# Altium project Convertor.PrjPCB
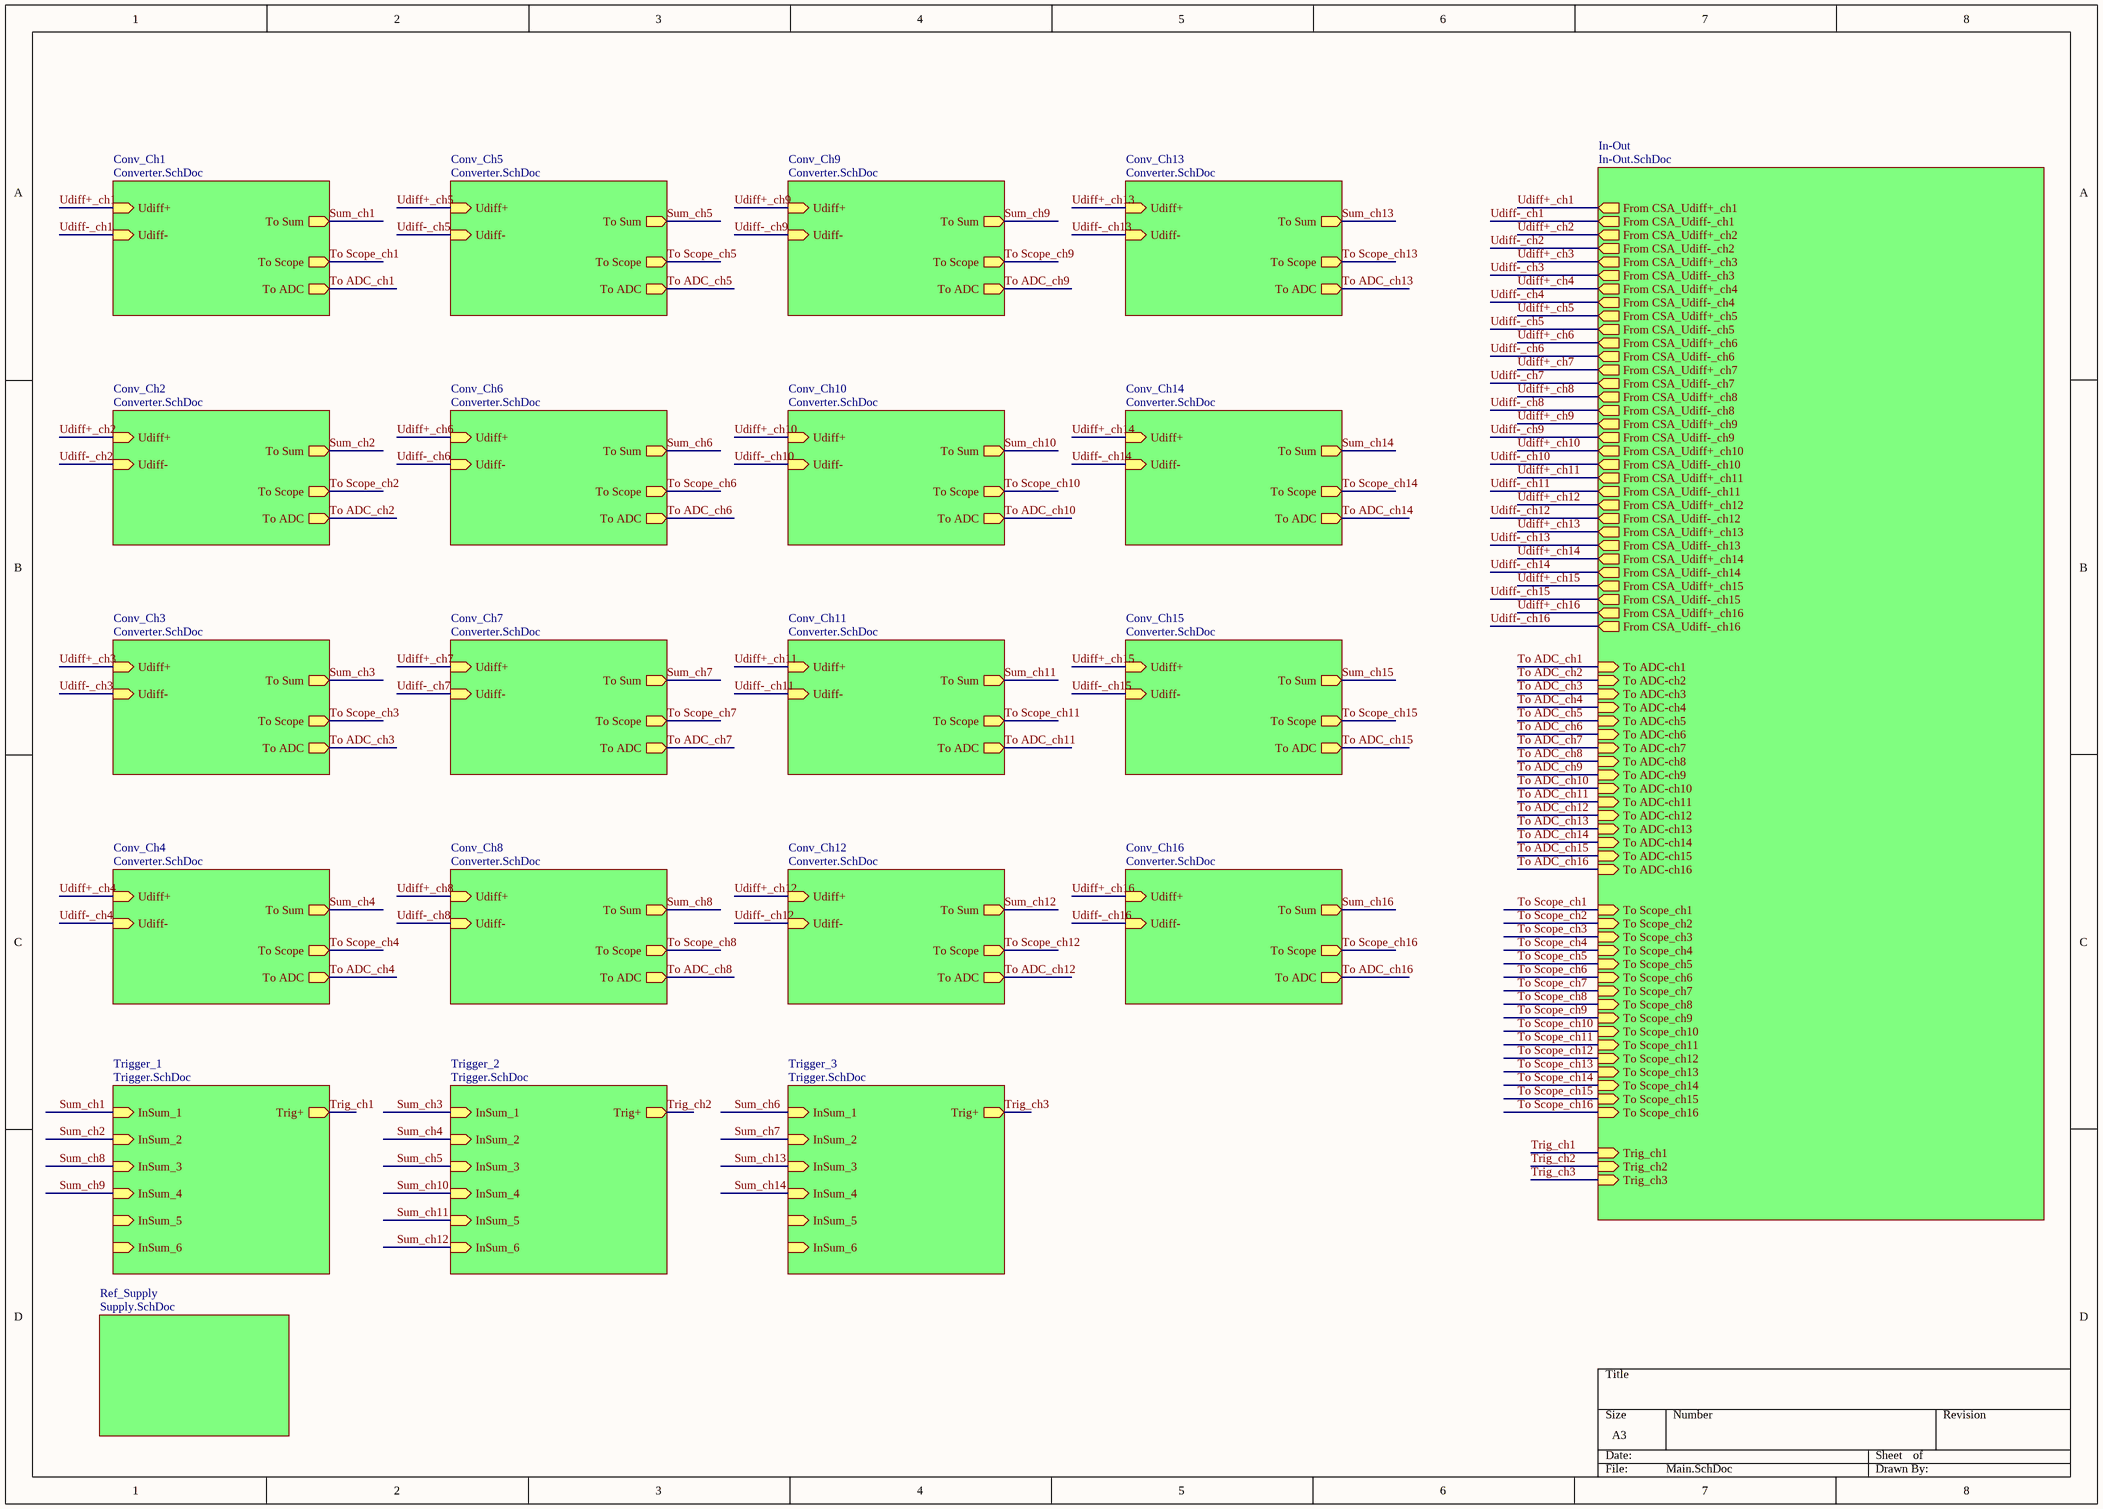
[diagram p0: Main.SchDoc]
5 sheets, 263 parts. Net scope: hierarchical (ports join the sheet entries above them; power ports are global).
Sheets:
  Main.SchDoc
    Conv_Ch1 = Converter.SchDoc
    Conv_Ch2 = Converter.SchDoc
    Conv_Ch3 = Converter.SchDoc
    Conv_Ch4 = Converter.SchDoc
    Conv_Ch5 = Converter.SchDoc
    Conv_Ch6 = Converter.SchDoc
    Conv_Ch7 = Converter.SchDoc
    Conv_Ch8 = Converter.SchDoc
    Conv_Ch9 = Converter.SchDoc
    Conv_Ch10 = Converter.SchDoc
    Conv_Ch11 = Converter.SchDoc
    Conv_Ch12 = Converter.SchDoc
    Conv_Ch13 = Converter.SchDoc
    Conv_Ch14 = Converter.SchDoc
    Conv_Ch15 = Converter.SchDoc
    Conv_Ch16 = Converter.SchDoc
    In-Out = In-Out.SchDoc
    Ref_Supply = Supply.SchDoc
    Trigger_1 = Trigger.SchDoc
    Trigger_2 = Trigger.SchDoc
    Trigger_3 = Trigger.SchDoc

## Sheet Main.SchDoc
size A3

### Sub-sheets
Conv_Ch1 = Converter.SchDoc: Udiff+ (in), Udiff- (in), To ADC (out), To Sum (out), To Scope (out)
Conv_Ch2 = Converter.SchDoc: Udiff+ (in), Udiff- (in), To ADC (out), To Sum (out), To Scope (out)
Conv_Ch3 = Converter.SchDoc: Udiff+ (in), Udiff- (in), To ADC (out), To Sum (out), To Scope (out)
Conv_Ch4 = Converter.SchDoc: Udiff+ (in), Udiff- (in), To ADC (out), To Sum (out), To Scope (out)
Conv_Ch5 = Converter.SchDoc: Udiff+ (in), Udiff- (in), To ADC (out), To Sum (out), To Scope (out)
Conv_Ch6 = Converter.SchDoc: Udiff+ (in), Udiff- (in), To ADC (out), To Sum (out), To Scope (out)
Conv_Ch7 = Converter.SchDoc: Udiff+ (in), Udiff- (in), To ADC (out), To Sum (out), To Scope (out)
Conv_Ch8 = Converter.SchDoc: Udiff+ (in), Udiff- (in), To ADC (out), To Sum (out), To Scope (out)
Conv_Ch9 = Converter.SchDoc: Udiff+ (in), Udiff- (in), To ADC (out), To Sum (out), To Scope (out)
Conv_Ch10 = Converter.SchDoc: Udiff+ (in), Udiff- (in), To ADC (out), To Sum (out), To Scope (out)
Conv_Ch11 = Converter.SchDoc: Udiff+ (in), Udiff- (in), To ADC (out), To Sum (out), To Scope (out)
Conv_Ch12 = Converter.SchDoc: Udiff+ (in), Udiff- (in), To ADC (out), To Sum (out), To Scope (out)
Conv_Ch13 = Converter.SchDoc: Udiff+ (in), Udiff- (in), To ADC (out), To Sum (out), To Scope (out)
Conv_Ch14 = Converter.SchDoc: Udiff+ (in), Udiff- (in), To ADC (out), To Sum (out), To Scope (out)
Conv_Ch15 = Converter.SchDoc: Udiff+ (in), Udiff- (in), To ADC (out), To Sum (out), To Scope (out)
Conv_Ch16 = Converter.SchDoc: Udiff+ (in), Udiff- (in), To ADC (out), To Sum (out), To Scope (out)
In-Out = In-Out.SchDoc: To ADC-ch1 (in), To ADC-ch2 (in), To ADC-ch3 (in), To ADC-ch4 (in), To ADC-ch5 (in), To ADC-ch6 (in), To ADC-ch7 (in), To ADC-ch8 (in), To ADC-ch9 (in), To ADC-ch10 (in), To ADC-ch11 (in), To ADC-ch12 (in), To ADC-ch13 (in), To ADC-ch14 (in), From CSA_Udiff+_ch1 (out), From CSA_Udiff+_ch2 (out), From CSA_Udiff+_ch3 (out), From CSA_Udiff+_ch4 (out), From CSA_Udiff+_ch5 (out), From CSA_Udiff+_ch6 (out), From CSA_Udiff+_ch7 (out), From CSA_Udiff+_ch8 (out), From CSA_Udiff+_ch9 (out), From CSA_Udiff+_ch10 (out), From CSA_Udiff+_ch11 (out), From CSA_Udiff+_ch12 (out), From CSA_Udiff+_ch13 (out), From CSA_Udiff+_ch14 (out), From CSA_Udiff-_ch1 (out), From CSA_Udiff-_ch2 (out), From CSA_Udiff-_ch3 (out), From CSA_Udiff-_ch4 (out), From CSA_Udiff-_ch5 (out), From CSA_Udiff-_ch6 (out), From CSA_Udiff-_ch7 (out), From CSA_Udiff-_ch8 (out), From CSA_Udiff-_ch9 (out), From CSA_Udiff-_ch10 (out), From CSA_Udiff-_ch11 (out), From CSA_Udiff-_ch12 (out), From CSA_Udiff-_ch13 (out), From CSA_Udiff-_ch14 (out), To ADC-ch15 (in), To ADC-ch16 (in), From CSA_Udiff+_ch15 (out), From CSA_Udiff+_ch16 (out), From CSA_Udiff-_ch15 (out), From CSA_Udiff-_ch16 (out), Trig_ch1 (in), Trig_ch2 (in), Trig_ch3 (in), To Scope_ch1 (in), To Scope_ch2 (in), To Scope_ch3 (in), To Scope_ch4 (in), To Scope_ch5 (in), To Scope_ch6 (in), To Scope_ch7 (in), To Scope_ch8 (in), To Scope_ch9 (in), To Scope_ch10 (in), To Scope_ch11 (in), To Scope_ch12 (in), To Scope_ch13 (in), To Scope_ch14 (in), To Scope_ch15 (in), To Scope_ch16 (in)
Ref_Supply = Supply.SchDoc: no entries
Trigger_1 = Trigger.SchDoc: InSum_1 (in), InSum_2 (in), InSum_3 (in), InSum_4 (in), Trig+ (out), InSum_5 (in), InSum_6 (in)
Trigger_2 = Trigger.SchDoc: InSum_1 (in), InSum_2 (in), InSum_3 (in), InSum_4 (in), Trig+ (out), InSum_5 (in), InSum_6 (in)
Trigger_3 = Trigger.SchDoc: InSum_1 (in), InSum_2 (in), InSum_3 (in), InSum_4 (in), Trig+ (out), InSum_5 (in), InSum_6 (in)

### Nets
Sum_ch1: sheet Conv_Ch1/To Sum, sheet Conv_Ch2/To Sum, sheet Conv_Ch8/To Sum, sheet Conv_Ch9/To Sum, sheet Trigger_1/InSum_1, sheet Trigger_1/InSum_2, sheet Trigger_1/InSum_3, sheet Trigger_1/InSum_4, sheet Trigger_1/InSum_5, sheet Trigger_1/InSum_6  [also labelled Sum_ch2, Sum_ch8, Sum_ch9]
Sum_ch10: sheet Conv_Ch3/To Sum, sheet Conv_Ch4/To Sum, sheet Conv_Ch5/To Sum, sheet Conv_Ch10/To Sum, sheet Conv_Ch11/To Sum, sheet Conv_Ch12/To Sum, sheet Trigger_2/InSum_1, sheet Trigger_2/InSum_2, sheet Trigger_2/InSum_3, sheet Trigger_2/InSum_4, sheet Trigger_2/InSum_5, sheet Trigger_2/InSum_6  [also labelled Sum_ch11, Sum_ch12, Sum_ch3, Sum_ch4, Sum_ch5]
Sum_ch13: sheet Conv_Ch6/To Sum, sheet Conv_Ch7/To Sum, sheet Conv_Ch13/To Sum, sheet Conv_Ch14/To Sum, sheet Trigger_3/InSum_1, sheet Trigger_3/InSum_2, sheet Trigger_3/InSum_3, sheet Trigger_3/InSum_4, sheet Trigger_3/InSum_5, sheet Trigger_3/InSum_6  [also labelled Sum_ch14, Sum_ch6, Sum_ch7]
To ADC_ch1: sheet Conv_Ch1/To ADC, sheet In-Out/To ADC-ch1
To ADC_ch2: sheet Conv_Ch2/To ADC, sheet In-Out/To ADC-ch2
To ADC_ch3: sheet Conv_Ch3/To ADC, sheet In-Out/To ADC-ch3
To ADC_ch4: sheet Conv_Ch4/To ADC, sheet In-Out/To ADC-ch4
To ADC_ch5: sheet Conv_Ch5/To ADC, sheet In-Out/To ADC-ch5
To ADC_ch6: sheet Conv_Ch6/To ADC, sheet In-Out/To ADC-ch6
To ADC_ch7: sheet Conv_Ch7/To ADC, sheet In-Out/To ADC-ch7
To ADC_ch8: sheet Conv_Ch8/To ADC, sheet In-Out/To ADC-ch8
To ADC_ch9: sheet Conv_Ch9/To ADC, sheet In-Out/To ADC-ch9
To ADC_ch10: sheet Conv_Ch10/To ADC, sheet In-Out/To ADC-ch10
To ADC_ch11: sheet Conv_Ch11/To ADC, sheet In-Out/To ADC-ch11
To ADC_ch12: sheet Conv_Ch12/To ADC, sheet In-Out/To ADC-ch12
To ADC_ch13: sheet Conv_Ch13/To ADC, sheet In-Out/To ADC-ch13
To ADC_ch14: sheet Conv_Ch14/To ADC, sheet In-Out/To ADC-ch14
To ADC_ch15: sheet Conv_Ch15/To ADC, sheet In-Out/To ADC-ch15
To ADC_ch16: sheet Conv_Ch16/To ADC, sheet In-Out/To ADC-ch16
To Scope_ch1: sheet Conv_Ch1/To Scope, sheet In-Out/To Scope_ch1
To Scope_ch2: sheet Conv_Ch2/To Scope, sheet In-Out/To Scope_ch2
To Scope_ch3: sheet Conv_Ch3/To Scope, sheet In-Out/To Scope_ch3
To Scope_ch4: sheet Conv_Ch4/To Scope, sheet In-Out/To Scope_ch4
To Scope_ch5: sheet Conv_Ch5/To Scope, sheet In-Out/To Scope_ch5
To Scope_ch6: sheet Conv_Ch6/To Scope, sheet In-Out/To Scope_ch6
To Scope_ch7: sheet Conv_Ch7/To Scope, sheet In-Out/To Scope_ch7
To Scope_ch8: sheet Conv_Ch8/To Scope, sheet In-Out/To Scope_ch8
To Scope_ch9: sheet Conv_Ch9/To Scope, sheet In-Out/To Scope_ch9
To Scope_ch10: sheet Conv_Ch10/To Scope, sheet In-Out/To Scope_ch10
To Scope_ch11: sheet Conv_Ch11/To Scope, sheet In-Out/To Scope_ch11
To Scope_ch12: sheet Conv_Ch12/To Scope, sheet In-Out/To Scope_ch12
To Scope_ch13: sheet Conv_Ch13/To Scope, sheet In-Out/To Scope_ch13
To Scope_ch14: sheet Conv_Ch14/To Scope, sheet In-Out/To Scope_ch14
To Scope_ch15: sheet Conv_Ch15/To Scope, sheet In-Out/To Scope_ch15
To Scope_ch16: sheet Conv_Ch16/To Scope, sheet In-Out/To Scope_ch16
Trig_ch1: sheet In-Out/Trig_ch1, sheet Trigger_1/Trig+
Trig_ch2: sheet In-Out/Trig_ch2, sheet Trigger_2/Trig+
Trig_ch3: sheet In-Out/Trig_ch3, sheet Trigger_3/Trig+
Udiff+_ch1: sheet Conv_Ch1/Udiff+, sheet In-Out/From CSA_Udiff+_ch1
Udiff+_ch2: sheet Conv_Ch2/Udiff+, sheet In-Out/From CSA_Udiff+_ch2
Udiff+_ch3: sheet Conv_Ch3/Udiff+, sheet In-Out/From CSA_Udiff+_ch3
Udiff+_ch4: sheet Conv_Ch4/Udiff+, sheet In-Out/From CSA_Udiff+_ch4
Udiff+_ch5: sheet Conv_Ch5/Udiff+, sheet In-Out/From CSA_Udiff+_ch5
Udiff+_ch6: sheet Conv_Ch6/Udiff+, sheet In-Out/From CSA_Udiff+_ch6
Udiff+_ch7: sheet Conv_Ch7/Udiff+, sheet In-Out/From CSA_Udiff+_ch7
Udiff+_ch8: sheet Conv_Ch8/Udiff+, sheet In-Out/From CSA_Udiff+_ch8
Udiff+_ch9: sheet Conv_Ch9/Udiff+, sheet In-Out/From CSA_Udiff+_ch9
Udiff+_ch10: sheet Conv_Ch10/Udiff+, sheet In-Out/From CSA_Udiff+_ch10
Udiff+_ch11: sheet Conv_Ch11/Udiff+, sheet In-Out/From CSA_Udiff+_ch11
Udiff+_ch12: sheet Conv_Ch12/Udiff+, sheet In-Out/From CSA_Udiff+_ch12
Udiff+_ch13: sheet Conv_Ch13/Udiff+, sheet In-Out/From CSA_Udiff+_ch13
Udiff+_ch14: sheet Conv_Ch14/Udiff+, sheet In-Out/From CSA_Udiff+_ch14
Udiff+_ch15: sheet Conv_Ch15/Udiff+, sheet In-Out/From CSA_Udiff+_ch15
Udiff+_ch16: sheet Conv_Ch16/Udiff+, sheet In-Out/From CSA_Udiff+_ch16
Udiff-_ch1: sheet Conv_Ch1/Udiff-, sheet In-Out/From CSA_Udiff-_ch1
Udiff-_ch2: sheet Conv_Ch2/Udiff-, sheet In-Out/From CSA_Udiff-_ch2
Udiff-_ch3: sheet Conv_Ch3/Udiff-, sheet In-Out/From CSA_Udiff-_ch3
Udiff-_ch4: sheet Conv_Ch4/Udiff-, sheet In-Out/From CSA_Udiff-_ch4
Udiff-_ch5: sheet Conv_Ch5/Udiff-, sheet In-Out/From CSA_Udiff-_ch5
Udiff-_ch6: sheet Conv_Ch6/Udiff-, sheet In-Out/From CSA_Udiff-_ch6
Udiff-_ch7: sheet Conv_Ch7/Udiff-, sheet In-Out/From CSA_Udiff-_ch7
Udiff-_ch8: sheet Conv_Ch8/Udiff-, sheet In-Out/From CSA_Udiff-_ch8
Udiff-_ch9: sheet Conv_Ch9/Udiff-, sheet In-Out/From CSA_Udiff-_ch9
Udiff-_ch10: sheet Conv_Ch10/Udiff-, sheet In-Out/From CSA_Udiff-_ch10
Udiff-_ch11: sheet Conv_Ch11/Udiff-, sheet In-Out/From CSA_Udiff-_ch11
Udiff-_ch12: sheet Conv_Ch12/Udiff-, sheet In-Out/From CSA_Udiff-_ch12
Udiff-_ch13: sheet Conv_Ch13/Udiff-, sheet In-Out/From CSA_Udiff-_ch13
Udiff-_ch14: sheet Conv_Ch14/Udiff-, sheet In-Out/From CSA_Udiff-_ch14
Udiff-_ch15: sheet Conv_Ch15/Udiff-, sheet In-Out/From CSA_Udiff-_ch15
Udiff-_ch16: sheet Conv_Ch16/Udiff-, sheet In-Out/From CSA_Udiff-_ch16

## Sheet Converter.SchDoc
size A4
Used 16 times, as channels Conv_Ch1, Conv_Ch2, Conv_Ch3, Conv_Ch4, Conv_Ch5, Conv_Ch6, Conv_Ch7, Conv_Ch8, Conv_Ch9, Conv_Ch10, Conv_Ch11, Conv_Ch12, Conv_Ch13, Conv_Ch14, Conv_Ch15, Conv_Ch16. Parts and nets are listed once, with the designators drawn on the sheet.
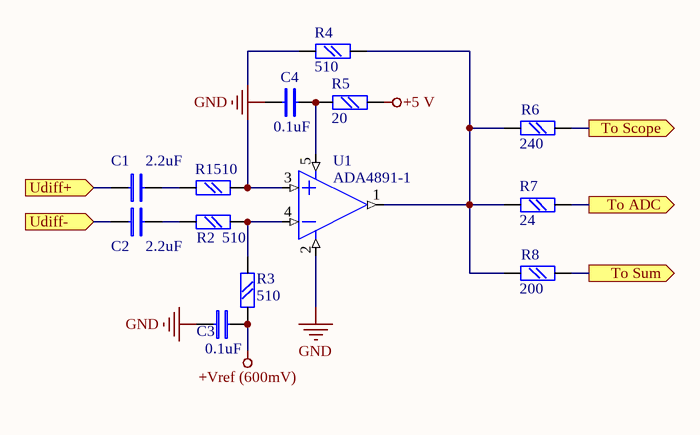
[diagram p1: Converter.SchDoc]

### Parts
C1  2.2uF  [chip0603]
C2  2.2uF  [chip0603]
C3  0.1uF  [chip0603]
C4  0.1uF  [chip0603]
R1  510  [chip0603]
R2  510  [chip0603]
R3  510  [chip0603]
R4  510  [chip0603]
R5  20  [chip0603]
R6  240  [chip0603]
R7  24  [chip0603]
R8  200  [chip0603]
U1  ADA4891-1  [SOT23-5]

### Ports
To ADC (out), To Scope (out), To Sum (out), Udiff+ (in), Udiff- (in)

### Nets
+5 V: R5.1
+Vref (600mV): C3.2 R3.2
GND: C3.1 C4.1 U1.2(E-)
To ADC: R7.2 ; port To ADC
To Scope: R6.2 ; port To Scope
To Sum: R8.2 ; port To Sum
Udiff+: C1.1 ; port Udiff+
Udiff-: C2.1 ; port Udiff-
NetC1_2: C1.2 R1.1
NetC2_2: C2.2 R2.1
NetC4_2: C4.2 R5.2 U1.5(E+)
NetR1_2: R1.2 R4.1 U1.3(+IN)
NetR2_2: R2.2 R3.1 U1.4(-IN)
NetR4_2: R4.2 R6.1 R7.1 R8.1 U1.1(OUT)

### Channels
Conv_Ch1: designators end in _Conv_Ch1; ports To ADC=To ADC_ch1 To Scope=To Scope_ch1 To Sum=Sum_ch1 Udiff+=Udiff+_ch1 Udiff-=Udiff-_ch1
Conv_Ch2: designators end in _Conv_Ch2; ports To ADC=To ADC_ch2 To Scope=To Scope_ch2 To Sum=Sum_ch1 Udiff+=Udiff+_ch2 Udiff-=Udiff-_ch2
Conv_Ch3: designators end in _Conv_Ch3; ports To ADC=To ADC_ch3 To Scope=To Scope_ch3 To Sum=Sum_ch10 Udiff+=Udiff+_ch3 Udiff-=Udiff-_ch3
Conv_Ch4: designators end in _Conv_Ch4; ports To ADC=To ADC_ch4 To Scope=To Scope_ch4 To Sum=Sum_ch10 Udiff+=Udiff+_ch4 Udiff-=Udiff-_ch4
Conv_Ch5: designators end in _Conv_Ch5; ports To ADC=To ADC_ch5 To Scope=To Scope_ch5 To Sum=Sum_ch10 Udiff+=Udiff+_ch5 Udiff-=Udiff-_ch5
Conv_Ch6: designators end in _Conv_Ch6; ports To ADC=To ADC_ch6 To Scope=To Scope_ch6 To Sum=Sum_ch13 Udiff+=Udiff+_ch6 Udiff-=Udiff-_ch6
Conv_Ch7: designators end in _Conv_Ch7; ports To ADC=To ADC_ch7 To Scope=To Scope_ch7 To Sum=Sum_ch13 Udiff+=Udiff+_ch7 Udiff-=Udiff-_ch7
Conv_Ch8: designators end in _Conv_Ch8; ports To ADC=To ADC_ch8 To Scope=To Scope_ch8 To Sum=Sum_ch1 Udiff+=Udiff+_ch8 Udiff-=Udiff-_ch8
Conv_Ch9: designators end in _Conv_Ch9; ports To ADC=To ADC_ch9 To Scope=To Scope_ch9 To Sum=Sum_ch1 Udiff+=Udiff+_ch9 Udiff-=Udiff-_ch9
Conv_Ch10: designators end in _Conv_Ch10; ports To ADC=To ADC_ch10 To Scope=To Scope_ch10 To Sum=Sum_ch10 Udiff+=Udiff+_ch10 Udiff-=Udiff-_ch10
Conv_Ch11: designators end in _Conv_Ch11; ports To ADC=To ADC_ch11 To Scope=To Scope_ch11 To Sum=Sum_ch10 Udiff+=Udiff+_ch11 Udiff-=Udiff-_ch11
Conv_Ch12: designators end in _Conv_Ch12; ports To ADC=To ADC_ch12 To Scope=To Scope_ch12 To Sum=Sum_ch10 Udiff+=Udiff+_ch12 Udiff-=Udiff-_ch12
Conv_Ch13: designators end in _Conv_Ch13; ports To ADC=To ADC_ch13 To Scope=To Scope_ch13 To Sum=Sum_ch13 Udiff+=Udiff+_ch13 Udiff-=Udiff-_ch13
Conv_Ch14: designators end in _Conv_Ch14; ports To ADC=To ADC_ch14 To Scope=To Scope_ch14 To Sum=Sum_ch13 Udiff+=Udiff+_ch14 Udiff-=Udiff-_ch14
Conv_Ch15: designators end in _Conv_Ch15; ports To ADC=To ADC_ch15 To Scope=To Scope_ch15 To Sum=Sum_ch15 Udiff+=Udiff+_ch15 Udiff-=Udiff-_ch15
Conv_Ch16: designators end in _Conv_Ch16; ports To ADC=To ADC_ch16 To Scope=To Scope_ch16 To Sum=Sum_ch16 Udiff+=Udiff+_ch16 Udiff-=Udiff-_ch16

### Library data of the parts
C1-C4 = C: Text Field1: 20; Text Field2: 10
R1-R4 R6-R8 = R: Text Field1: 20; Text Field2: 20
R5 = R: Text Field1: 20; Text Field2: 20
U1 = AD8005ART: Text Field1: 40; Text Field2: 40

## Sheet In-Out.SchDoc
size A4
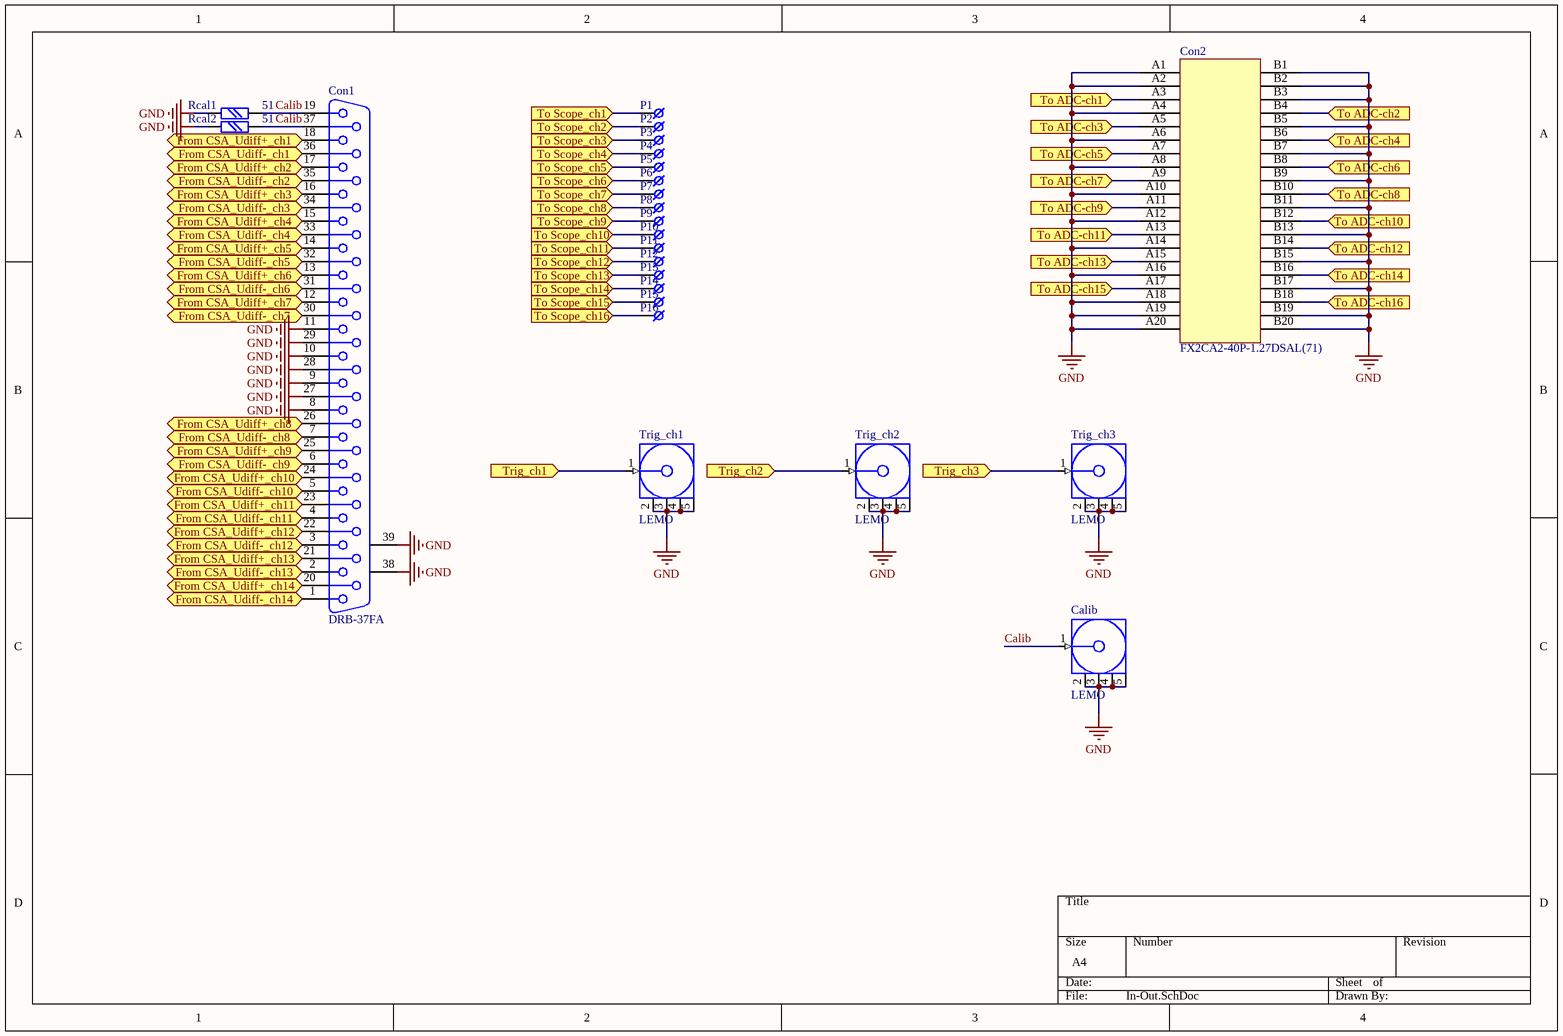
[diagram p2: In-Out.SchDoc]

### Parts
Calib  LEMO  [LEMO]
Con1  DRB-37FA  [DBR-F-37]
Con2  FX2CA2-40P-1.27DSAL(71)
P1  KLEMME  [Pad12]  (value not drawn)
P2  KLEMME  [Pad12]  (value not drawn)
P3  KLEMME  [Pad12]  (value not drawn)
P4  KLEMME  [Pad12]  (value not drawn)
P5  KLEMME  [Pad12]  (value not drawn)
P6  KLEMME  [Pad12]  (value not drawn)
P7  KLEMME  [Pad12]  (value not drawn)
P8  KLEMME  [Pad12]  (value not drawn)
P9  KLEMME  [Pad12]  (value not drawn)
P10  KLEMME  [Pad12]  (value not drawn)
P11  KLEMME  [Pad12]  (value not drawn)
P12  KLEMME  [Pad12]  (value not drawn)
P13  KLEMME  [Pad12]  (value not drawn)
P14  KLEMME  [Pad12]  (value not drawn)
P15  KLEMME  [Pad12]  (value not drawn)
P16  KLEMME  [Pad12]  (value not drawn)
Rcal1  51  [chip0603]
Rcal2  51  [chip0603]
Trig_ch1  LEMO  [LEMO]
Trig_ch2  LEMO  [LEMO]
Trig_ch3  LEMO  [LEMO]

### Ports
From CSA_Udiff+_ch1 (in), From CSA_Udiff+_ch2 (in), From CSA_Udiff+_ch3 (in), From CSA_Udiff+_ch4 (in), From CSA_Udiff+_ch5 (in), From CSA_Udiff+_ch6 (in), From CSA_Udiff+_ch7 (in), From CSA_Udiff+_ch8 (in), From CSA_Udiff+_ch9 (in), From CSA_Udiff+_ch10 (in), From CSA_Udiff+_ch11 (in), From CSA_Udiff+_ch12 (in), From CSA_Udiff+_ch13 (in), From CSA_Udiff+_ch14 (in), From CSA_Udiff-_ch1 (in), From CSA_Udiff-_ch2 (in), From CSA_Udiff-_ch3 (in), From CSA_Udiff-_ch4 (in), From CSA_Udiff-_ch5 (in), From CSA_Udiff-_ch6 (in), From CSA_Udiff-_ch7 (in), From CSA_Udiff-_ch8 (in), From CSA_Udiff-_ch9 (in), From CSA_Udiff-_ch10 (in), From CSA_Udiff-_ch11 (in), From CSA_Udiff-_ch12 (in), From CSA_Udiff-_ch13 (in), From CSA_Udiff-_ch14 (in), To ADC-ch1 (in), To ADC-ch2 (in), To ADC-ch3 (in), To ADC-ch4 (in), To ADC-ch5 (in), To ADC-ch6 (in), To ADC-ch7 (in), To ADC-ch8 (in), To ADC-ch9 (in), To ADC-ch10 (in), To ADC-ch11 (in), To ADC-ch12 (in), To ADC-ch13 (in), To ADC-ch14 (in), To ADC-ch15 (in), To ADC-ch16 (in), To Scope_ch1 (in), To Scope_ch2 (in), To Scope_ch3 (in), To Scope_ch4 (in), To Scope_ch5 (in), To Scope_ch6 (in), To Scope_ch7 (in), To Scope_ch8 (in), To Scope_ch9 (in), To Scope_ch10 (in), To Scope_ch11 (in), To Scope_ch12 (in), To Scope_ch13 (in), To Scope_ch14 (in), To Scope_ch15 (in), To Scope_ch16 (in), Trig_ch1 (in), Trig_ch2 (in), Trig_ch3 (in)

### Nets
GND: Calib.2(GND) Calib.3(GND) Calib.4(GND) Calib.5(GND) Con1.8 Con1.9 Con1.10 Con1.11 Con1.27 Con1.28 Con1.29 Con1.38 Con1.39 Con2.A1 Con2.A2 Con2.A4 Con2.A6 Con2.A8 Con2.A10 Con2.A12 Con2.A14 Con2.A16 Con2.A18 Con2.A19 Con2.A20 Con2.B1 Con2.B2 Con2.B3 Con2.B5 Con2.B7 Con2.B9 Con2.B11 Con2.B13 Con2.B15 Con2.B17 Con2.B19 Con2.B20 Rcal1.2 Rcal2.2 Trig_ch1.2(GND) Trig_ch1.3(GND) Trig_ch1.4(GND) Trig_ch1.5(GND) Trig_ch2.2(GND) Trig_ch2.3(GND) Trig_ch2.4(GND) Trig_ch2.5(GND) Trig_ch3.2(GND) Trig_ch3.3(GND) Trig_ch3.4(GND) Trig_ch3.5(GND)
Calib: Calib.1(Signal) Con1.19 Con1.37 Rcal1.1 Rcal2.1
To ADC_ch1: Con2.A3 ; port To ADC-ch1
To ADC_ch2: Con2.B4 ; port To ADC-ch2
To ADC_ch3: Con2.A5 ; port To ADC-ch3
To ADC_ch4: Con2.B6 ; port To ADC-ch4
To ADC_ch5: Con2.A7 ; port To ADC-ch5
To ADC_ch6: Con2.B8 ; port To ADC-ch6
To ADC_ch7: Con2.A9 ; port To ADC-ch7
To ADC_ch8: Con2.B10 ; port To ADC-ch8
To ADC_ch9: Con2.A11 ; port To ADC-ch9
To ADC_ch10: Con2.B12 ; port To ADC-ch10
To ADC_ch11: Con2.A13 ; port To ADC-ch11
To ADC_ch12: Con2.B14 ; port To ADC-ch12
To ADC_ch13: Con2.A15 ; port To ADC-ch13
To ADC_ch14: Con2.B16 ; port To ADC-ch14
To ADC_ch15: Con2.A17 ; port To ADC-ch15
To ADC_ch16: Con2.B18 ; port To ADC-ch16
To Scope_ch1: P1.PAD ; port To Scope_ch1
To Scope_ch2: P2.PAD ; port To Scope_ch2
To Scope_ch3: P3.PAD ; port To Scope_ch3
To Scope_ch4: P4.PAD ; port To Scope_ch4
To Scope_ch5: P5.PAD ; port To Scope_ch5
To Scope_ch6: P6.PAD ; port To Scope_ch6
To Scope_ch7: P7.PAD ; port To Scope_ch7
To Scope_ch8: P8.PAD ; port To Scope_ch8
To Scope_ch9: P9.PAD ; port To Scope_ch9
To Scope_ch10: P10.PAD ; port To Scope_ch10
To Scope_ch11: P11.PAD ; port To Scope_ch11
To Scope_ch12: P12.PAD ; port To Scope_ch12
To Scope_ch13: P13.PAD ; port To Scope_ch13
To Scope_ch14: P14.PAD ; port To Scope_ch14
To Scope_ch15: P15.PAD ; port To Scope_ch15
To Scope_ch16: P16.PAD ; port To Scope_ch16
Trig_ch1: Trig_ch1.1(Signal) ; port Trig_ch1
Trig_ch2: Trig_ch2.1(Signal) ; port Trig_ch2
Trig_ch3: Trig_ch3.1(Signal) ; port Trig_ch3
Udiff+_ch1: Con1.18 ; port From CSA_Udiff+_ch1
Udiff+_ch2: Con1.17 ; port From CSA_Udiff+_ch2
Udiff+_ch3: Con1.16 ; port From CSA_Udiff+_ch3
Udiff+_ch4: Con1.15 ; port From CSA_Udiff+_ch4
Udiff+_ch5: Con1.14 ; port From CSA_Udiff+_ch5
Udiff+_ch6: Con1.13 ; port From CSA_Udiff+_ch6
Udiff+_ch7: Con1.12 ; port From CSA_Udiff+_ch7
Udiff+_ch8: Con1.26 ; port From CSA_Udiff+_ch8
Udiff+_ch9: Con1.25 ; port From CSA_Udiff+_ch9
Udiff+_ch10: Con1.24 ; port From CSA_Udiff+_ch10
Udiff+_ch11: Con1.23 ; port From CSA_Udiff+_ch11
Udiff+_ch12: Con1.22 ; port From CSA_Udiff+_ch12
Udiff+_ch13: Con1.21 ; port From CSA_Udiff+_ch13
Udiff+_ch14: Con1.20 ; port From CSA_Udiff+_ch14
Udiff-_ch1: Con1.36 ; port From CSA_Udiff-_ch1
Udiff-_ch2: Con1.35 ; port From CSA_Udiff-_ch2
Udiff-_ch3: Con1.34 ; port From CSA_Udiff-_ch3
Udiff-_ch4: Con1.33 ; port From CSA_Udiff-_ch4
Udiff-_ch5: Con1.32 ; port From CSA_Udiff-_ch5
Udiff-_ch6: Con1.31 ; port From CSA_Udiff-_ch6
Udiff-_ch7: Con1.30 ; port From CSA_Udiff-_ch7
Udiff-_ch8: Con1.7 ; port From CSA_Udiff-_ch8
Udiff-_ch9: Con1.6 ; port From CSA_Udiff-_ch9
Udiff-_ch10: Con1.5 ; port From CSA_Udiff-_ch10
Udiff-_ch11: Con1.4 ; port From CSA_Udiff-_ch11
Udiff-_ch12: Con1.3 ; port From CSA_Udiff-_ch12
Udiff-_ch13: Con1.2 ; port From CSA_Udiff-_ch13
Udiff-_ch14: Con1.1 ; port From CSA_Udiff-_ch14

### Library data of the parts
Calib Trig_ch1-Trig_ch3 = COAX-F: RF Coaxial PCB Connector, MCX; Thru-Hole, Right-Angle Mount Socket, Blunt Post Terminal, 50 Ohm Impedance; PCB_Layout: Complies with manufacturer's recommendation.; DrillSize: Corresponds to nominal value.; Published: 15-Jul-2004; LatestRevisionDate: 15-Jul-2004; LatestRevisionNote: Component Replaced.; DatasheetDocument: 30-May-2003; PackageDocument: 04-Jul-1999; PackageReference: 919-119J-51AX; Publisher: Altium Limited; ComponentLink1Description: Manufacturer Link; ComponentLink1URL: http://www.amphenolrf.com/
Con1 = DBR-37F
P1-P16 = KLEMME: Text Field1: 10; Text Field2: 20
Rcal1 Rcal2 = R: Text Field1: 20; Text Field2: 20

## Sheet Supply.SchDoc
size A4
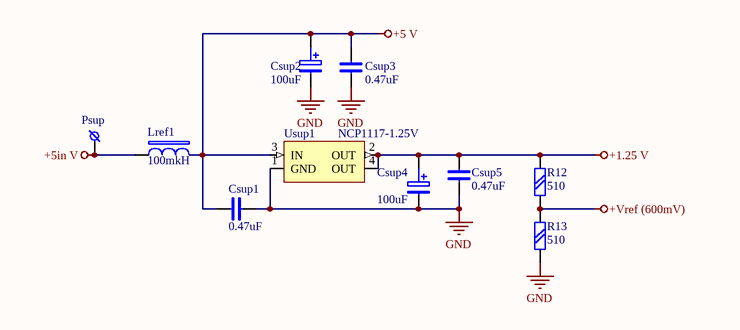
[diagram p3: Supply.SchDoc]

### Parts
Csup1  0.47uF  [chip0805]
Csup2  100uF  [CEL-SMD300]
Csup3  0.47uF  [chip0805]
Csup4  100uF  [CEL-SMD300]
Csup5  0.47uF  [chip0805]
Lref1  100mkH  [SDR0604]
Psup  KLEMME  [Pad12]  (value not drawn)
R12  510  [chip0805]
R13  510  [chip0805]
Usup1  NCP1117-1.25V  [TO-252]

### Nets
+1.25 V: Csup4.+ Csup5.1 R12.2 Usup1.2(OUT) Usup1.4(OUT)
+5 V: Csup1.1 Csup2.+ Csup3.1 Lref1.2 Usup1.3(IN)
+5in V: Lref1.1 Psup.PAD
+Vref (600mV): R12.1 R13.1
GND: Csup1.2 Csup2.- Csup3.2 Csup4.- Csup5.2 R13.2 Usup1.1(GND)

### Library data of the parts
Csup1 Csup3 Csup5 = C: Text Field1: 20; Text Field2: 10
Csup2 Csup4 = C POL: Text Field1: 20; Text Field2: 20
Lref1 = DR: Text Field1: 30; Text Field2: 10
Psup = KLEMME: Text Field1: 10; Text Field2: 20
R12 R13 = R: Text Field1: 20; Text Field2: 20
Usup1 = NCP1117-3.3V

## Sheet Trigger.SchDoc
size A4
Used 3 times, as channels Trigger_1, Trigger_2, Trigger_3. Parts and nets are listed once, with the designators drawn on the sheet.
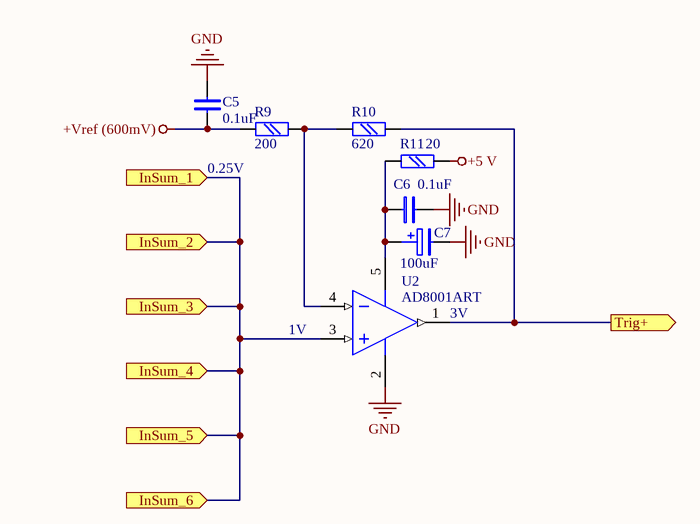
[diagram p4: Trigger.SchDoc]

### Parts
C5  0.1uF  [chip0603]
C6  0.1uF  [chip0603]
C7  100uF  [CEL-SMD300]
R9  200  [chip0603]
R10  620  [chip0603]
R11  20  [chip0603]
U2  AD8001ART  [RT-5]

### Ports
InSum_1 (in), InSum_2 (in), InSum_3 (in), InSum_4 (in), InSum_5 (in), InSum_6 (in), Trig+ (out)

### Nets
+5 V: R11.1
+Vref (600mV): C5.2 R9.2
GND: C5.1 C6.1 C7.- U2.2(V-)
InSum_1: U2.3(IN+) ; port InSum_1, port InSum_2, port InSum_3, port InSum_4, port InSum_5, port InSum_6
Trig+: R10.2 U2.1(OUT) ; port Trig+
NetC6_2: C6.2 C7.+ R11.2 U2.5(V+)
NetR9_1: R9.1 R10.1 U2.4(IN-)

### Channels
Trigger_1: designators end in _Trigger_1; ports InSum_1=Sum_ch1 InSum_2=Sum_ch1 InSum_3=Sum_ch1 InSum_4=Sum_ch1 InSum_5=Sum_ch1 InSum_6=Sum_ch1 Trig+=Trig_ch1
Trigger_2: designators end in _Trigger_2; ports InSum_1=Sum_ch10 InSum_2=Sum_ch10 InSum_3=Sum_ch10 InSum_4=Sum_ch10 InSum_5=Sum_ch10 InSum_6=Sum_ch10 Trig+=Trig_ch2
Trigger_3: designators end in _Trigger_3; ports InSum_1=Sum_ch13 InSum_2=Sum_ch13 InSum_3=Sum_ch13 InSum_4=Sum_ch13 InSum_5=Sum_ch13 InSum_6=Sum_ch13 Trig+=Trig_ch3

### Notes on the sheet
- 0.25V
- (near U2) 1V
- (near U2) 3V

### Library data of the parts
C5 C6 = C: Text Field1: 20; Text Field2: 10
C7 = C POL: Text Field1: 20; Text Field2: 20
R9 R10 = R: Text Field1: 20; Text Field2: 20
R11 = R: Text Field1: 20; Text Field2: 20
U2 = AD8055ART: Low Cost, 300MHz Voltage Feedback Amplifier; Published: 8-Jun-2000; LatestRevisionDate: 17-Jul-2002; LatestRevisionNote: Re-released for DXP Platform.; DatasheetVersion: REV. 0 1997; PackageReference: RT-5; Publisher: Altium Limited; PackageDescription: SOT-23/SC-74A; 5 Leads; Body 3.1 x 3 mm, inc. leads (LxW max); Code_JEDEC: MO-178AA; ComponentLink1Description: Manufacturer Link; ComponentLink1URL: http://www.analog.com/en/prod/0,,759_786_AD8055%2C00.html; ComponentLink2Description: Datasheet; ComponentLink2URL: http://www.analog.com/UploadedFiles/Data_Sheets/40402558757264AD8055_6_i.pdf

## Nets that join several sheets
+5 V: Conv_Ch1 (R5_Conv_Ch1.1), Conv_Ch2 (R5_Conv_Ch2.1), Conv_Ch3 (R5_Conv_Ch3.1), Conv_Ch4 (R5_Conv_Ch4.1), Conv_Ch5 (R5_Conv_Ch5.1), Conv_Ch6 (R5_Conv_Ch6.1), Conv_Ch7 (R5_Conv_Ch7.1), Conv_Ch8 (R5_Conv_Ch8.1), Conv_Ch9 (R5_Conv_Ch9.1), Conv_Ch10 (R5_Conv_Ch10.1), Conv_Ch11 (R5_Conv_Ch11.1), Conv_Ch12 (R5_Conv_Ch12.1), Conv_Ch13 (R5_Conv_Ch13.1), Conv_Ch14 (R5_Conv_Ch14.1), Conv_Ch15 (R5_Conv_Ch15.1), Conv_Ch16 (R5_Conv_Ch16.1), Supply (5 pins), Trigger_1 (R11_Trigger_1.1), Trigger_2 (R11_Trigger_2.1), Trigger_3 (R11_Trigger_3.1)
+Vref (600mV): Conv_Ch1 (C3_Conv_Ch1.2 R3_Conv_Ch1.2), Conv_Ch2 (C3_Conv_Ch2.2 R3_Conv_Ch2.2), Conv_Ch3 (C3_Conv_Ch3.2 R3_Conv_Ch3.2), Conv_Ch4 (C3_Conv_Ch4.2 R3_Conv_Ch4.2), Conv_Ch5 (C3_Conv_Ch5.2 R3_Conv_Ch5.2), Conv_Ch6 (C3_Conv_Ch6.2 R3_Conv_Ch6.2), Conv_Ch7 (C3_Conv_Ch7.2 R3_Conv_Ch7.2), Conv_Ch8 (C3_Conv_Ch8.2 R3_Conv_Ch8.2), Conv_Ch9 (C3_Conv_Ch9.2 R3_Conv_Ch9.2), Conv_Ch10 (C3_Conv_Ch10.2 R3_Conv_Ch10.2), Conv_Ch11 (C3_Conv_Ch11.2 R3_Conv_Ch11.2), Conv_Ch12 (C3_Conv_Ch12.2 R3_Conv_Ch12.2), Conv_Ch13 (C3_Conv_Ch13.2 R3_Conv_Ch13.2), Conv_Ch14 (C3_Conv_Ch14.2 R3_Conv_Ch14.2), Conv_Ch15 (C3_Conv_Ch15.2 R3_Conv_Ch15.2), Conv_Ch16 (C3_Conv_Ch16.2 R3_Conv_Ch16.2), Supply (R12.1 R13.1), Trigger_1 (C5_Trigger_1.2 R9_Trigger_1.2), Trigger_2 (C5_Trigger_2.2 R9_Trigger_2.2), Trigger_3 (C5_Trigger_3.2 R9_Trigger_3.2)
GND: Conv_Ch1 (C3_Conv_Ch1.1 C4_Conv_Ch1.1 U1_Conv_Ch1.2), Conv_Ch2 (C3_Conv_Ch2.1 C4_Conv_Ch2.1 U1_Conv_Ch2.2), Conv_Ch3 (C3_Conv_Ch3.1 C4_Conv_Ch3.1 U1_Conv_Ch3.2), Conv_Ch4 (C3_Conv_Ch4.1 C4_Conv_Ch4.1 U1_Conv_Ch4.2), Conv_Ch5 (C3_Conv_Ch5.1 C4_Conv_Ch5.1 U1_Conv_Ch5.2), Conv_Ch6 (C3_Conv_Ch6.1 C4_Conv_Ch6.1 U1_Conv_Ch6.2), Conv_Ch7 (C3_Conv_Ch7.1 C4_Conv_Ch7.1 U1_Conv_Ch7.2), Conv_Ch8 (C3_Conv_Ch8.1 C4_Conv_Ch8.1 U1_Conv_Ch8.2), Conv_Ch9 (C3_Conv_Ch9.1 C4_Conv_Ch9.1 U1_Conv_Ch9.2), Conv_Ch10 (C3_Conv_Ch10.1 C4_Conv_Ch10.1 U1_Conv_Ch10.2), Conv_Ch11 (C3_Conv_Ch11.1 C4_Conv_Ch11.1 U1_Conv_Ch11.2), Conv_Ch12 (C3_Conv_Ch12.1 C4_Conv_Ch12.1 U1_Conv_Ch12.2), Conv_Ch13 (C3_Conv_Ch13.1 C4_Conv_Ch13.1 U1_Conv_Ch13.2), Conv_Ch14 (C3_Conv_Ch14.1 C4_Conv_Ch14.1 U1_Conv_Ch14.2), Conv_Ch15 (C3_Conv_Ch15.1 C4_Conv_Ch15.1 U1_Conv_Ch15.2), Conv_Ch16 (C3_Conv_Ch16.1 C4_Conv_Ch16.1 U1_Conv_Ch16.2), In-Out (51 pins), Supply (7 pins), Trigger_1 (C5_Trigger_1.1 C6_Trigger_1.1 C7_Trigger_1.- U2_Trigger_1.2), Trigger_2 (C5_Trigger_2.1 C6_Trigger_2.1 C7_Trigger_2.- U2_Trigger_2.2), Trigger_3 (C5_Trigger_3.1 C6_Trigger_3.1 C7_Trigger_3.- U2_Trigger_3.2)
Sum_ch1: Conv_Ch1 (R8_Conv_Ch1.2), Conv_Ch2 (R8_Conv_Ch2.2), Conv_Ch8 (R8_Conv_Ch8.2), Conv_Ch9 (R8_Conv_Ch9.2), Trigger_1 (U2_Trigger_1.3)
Sum_ch10: Conv_Ch3 (R8_Conv_Ch3.2), Conv_Ch4 (R8_Conv_Ch4.2), Conv_Ch5 (R8_Conv_Ch5.2), Conv_Ch10 (R8_Conv_Ch10.2), Conv_Ch11 (R8_Conv_Ch11.2), Conv_Ch12 (R8_Conv_Ch12.2), Trigger_2 (U2_Trigger_2.3)
Sum_ch13: Conv_Ch6 (R8_Conv_Ch6.2), Conv_Ch7 (R8_Conv_Ch7.2), Conv_Ch13 (R8_Conv_Ch13.2), Conv_Ch14 (R8_Conv_Ch14.2), Trigger_3 (U2_Trigger_3.3)
To ADC_ch1: Conv_Ch1 (R7_Conv_Ch1.2), In-Out (Con2.A3)
To ADC_ch2: Conv_Ch2 (R7_Conv_Ch2.2), In-Out (Con2.B4)
To ADC_ch3: Conv_Ch3 (R7_Conv_Ch3.2), In-Out (Con2.A5)
To ADC_ch4: Conv_Ch4 (R7_Conv_Ch4.2), In-Out (Con2.B6)
To ADC_ch5: Conv_Ch5 (R7_Conv_Ch5.2), In-Out (Con2.A7)
To ADC_ch6: Conv_Ch6 (R7_Conv_Ch6.2), In-Out (Con2.B8)
To ADC_ch7: Conv_Ch7 (R7_Conv_Ch7.2), In-Out (Con2.A9)
To ADC_ch8: Conv_Ch8 (R7_Conv_Ch8.2), In-Out (Con2.B10)
To ADC_ch9: Conv_Ch9 (R7_Conv_Ch9.2), In-Out (Con2.A11)
To ADC_ch10: Conv_Ch10 (R7_Conv_Ch10.2), In-Out (Con2.B12)
To ADC_ch11: Conv_Ch11 (R7_Conv_Ch11.2), In-Out (Con2.A13)
To ADC_ch12: Conv_Ch12 (R7_Conv_Ch12.2), In-Out (Con2.B14)
To ADC_ch13: Conv_Ch13 (R7_Conv_Ch13.2), In-Out (Con2.A15)
To ADC_ch14: Conv_Ch14 (R7_Conv_Ch14.2), In-Out (Con2.B16)
To ADC_ch15: Conv_Ch15 (R7_Conv_Ch15.2), In-Out (Con2.A17)
To ADC_ch16: Conv_Ch16 (R7_Conv_Ch16.2), In-Out (Con2.B18)
To Scope_ch1: Conv_Ch1 (R6_Conv_Ch1.2), In-Out (P1.PAD)
To Scope_ch2: Conv_Ch2 (R6_Conv_Ch2.2), In-Out (P2.PAD)
To Scope_ch3: Conv_Ch3 (R6_Conv_Ch3.2), In-Out (P3.PAD)
To Scope_ch4: Conv_Ch4 (R6_Conv_Ch4.2), In-Out (P4.PAD)
To Scope_ch5: Conv_Ch5 (R6_Conv_Ch5.2), In-Out (P5.PAD)
To Scope_ch6: Conv_Ch6 (R6_Conv_Ch6.2), In-Out (P6.PAD)
To Scope_ch7: Conv_Ch7 (R6_Conv_Ch7.2), In-Out (P7.PAD)
To Scope_ch8: Conv_Ch8 (R6_Conv_Ch8.2), In-Out (P8.PAD)
To Scope_ch9: Conv_Ch9 (R6_Conv_Ch9.2), In-Out (P9.PAD)
To Scope_ch10: Conv_Ch10 (R6_Conv_Ch10.2), In-Out (P10.PAD)
To Scope_ch11: Conv_Ch11 (R6_Conv_Ch11.2), In-Out (P11.PAD)
To Scope_ch12: Conv_Ch12 (R6_Conv_Ch12.2), In-Out (P12.PAD)
To Scope_ch13: Conv_Ch13 (R6_Conv_Ch13.2), In-Out (P13.PAD)
To Scope_ch14: Conv_Ch14 (R6_Conv_Ch14.2), In-Out (P14.PAD)
To Scope_ch15: Conv_Ch15 (R6_Conv_Ch15.2), In-Out (P15.PAD)
To Scope_ch16: Conv_Ch16 (R6_Conv_Ch16.2), In-Out (P16.PAD)
Trig_ch1: In-Out (Trig_ch1.1), Trigger_1 (R10_Trigger_1.2 U2_Trigger_1.1)
Trig_ch2: In-Out (Trig_ch2.1), Trigger_2 (R10_Trigger_2.2 U2_Trigger_2.1)
Trig_ch3: In-Out (Trig_ch3.1), Trigger_3 (R10_Trigger_3.2 U2_Trigger_3.1)
Udiff+_ch1: Conv_Ch1 (C1_Conv_Ch1.1), In-Out (Con1.18)
Udiff+_ch2: Conv_Ch2 (C1_Conv_Ch2.1), In-Out (Con1.17)
Udiff+_ch3: Conv_Ch3 (C1_Conv_Ch3.1), In-Out (Con1.16)
Udiff+_ch4: Conv_Ch4 (C1_Conv_Ch4.1), In-Out (Con1.15)
Udiff+_ch5: Conv_Ch5 (C1_Conv_Ch5.1), In-Out (Con1.14)
Udiff+_ch6: Conv_Ch6 (C1_Conv_Ch6.1), In-Out (Con1.13)
Udiff+_ch7: Conv_Ch7 (C1_Conv_Ch7.1), In-Out (Con1.12)
Udiff+_ch8: Conv_Ch8 (C1_Conv_Ch8.1), In-Out (Con1.26)
Udiff+_ch9: Conv_Ch9 (C1_Conv_Ch9.1), In-Out (Con1.25)
Udiff+_ch10: Conv_Ch10 (C1_Conv_Ch10.1), In-Out (Con1.24)
Udiff+_ch11: Conv_Ch11 (C1_Conv_Ch11.1), In-Out (Con1.23)
Udiff+_ch12: Conv_Ch12 (C1_Conv_Ch12.1), In-Out (Con1.22)
Udiff+_ch13: Conv_Ch13 (C1_Conv_Ch13.1), In-Out (Con1.21)
Udiff+_ch14: Conv_Ch14 (C1_Conv_Ch14.1), In-Out (Con1.20)
Udiff-_ch1: Conv_Ch1 (C2_Conv_Ch1.1), In-Out (Con1.36)
Udiff-_ch2: Conv_Ch2 (C2_Conv_Ch2.1), In-Out (Con1.35)
Udiff-_ch3: Conv_Ch3 (C2_Conv_Ch3.1), In-Out (Con1.34)
Udiff-_ch4: Conv_Ch4 (C2_Conv_Ch4.1), In-Out (Con1.33)
Udiff-_ch5: Conv_Ch5 (C2_Conv_Ch5.1), In-Out (Con1.32)
Udiff-_ch6: Conv_Ch6 (C2_Conv_Ch6.1), In-Out (Con1.31)
Udiff-_ch7: Conv_Ch7 (C2_Conv_Ch7.1), In-Out (Con1.30)
Udiff-_ch8: Conv_Ch8 (C2_Conv_Ch8.1), In-Out (Con1.7)
Udiff-_ch9: Conv_Ch9 (C2_Conv_Ch9.1), In-Out (Con1.6)
Udiff-_ch10: Conv_Ch10 (C2_Conv_Ch10.1), In-Out (Con1.5)
Udiff-_ch11: Conv_Ch11 (C2_Conv_Ch11.1), In-Out (Con1.4)
Udiff-_ch12: Conv_Ch12 (C2_Conv_Ch12.1), In-Out (Con1.3)
Udiff-_ch13: Conv_Ch13 (C2_Conv_Ch13.1), In-Out (Con1.2)
Udiff-_ch14: Conv_Ch14 (C2_Conv_Ch14.1), In-Out (Con1.1)